# EAGLE design 555-Sawtooth-VCO (EAGLE 7.2.0)
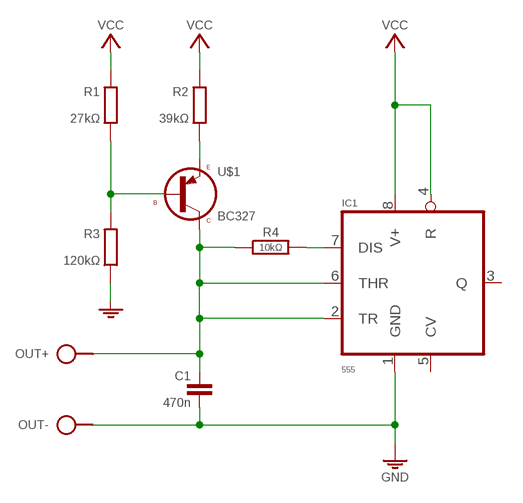
[diagram p0: schematic, sheet 1]

## Parts
C1  470n  C075-020X044/V  [C075-020X044/V]
IC1  555  555_ALT  [DIL08]
OUT  SPAD+--+  [SPAD-+]
R1  27kΩ  R0207/10  [0207/10]
R2  39kΩ  R0207/10  [0207/10]
R3  120kΩ  R0207/10  [0207/10]
R4  10kΩ  R-H0204/10  [0204/10]
S1  VCC_GNDPWR-R  [PWR-R]
U$1  BC327  [TO92]

## Nets
GND: C1.2 IC1.1(GND) OUT.1 R3.2 S1.1
N$2: IC1.7(DIS) R4.2
N$3: R2.2 U$1.3(E)
N$4: R1.2 R3.1 U$1.2(B)
TR: C1.1 IC1.2(TR) IC1.6(THR) OUT.2 R4.1 U$1.1(C)
VCC: IC1.4(R) IC1.8(V+) R1.1 R2.1 S1.2
Unconnected: IC1.3(Q) IC1.5(CV)

## Library data of the parts
C1 = c:C: CAPACITOR, European symbol
IC1 = ic:*555_ALT
OUT = pad:SPAD+-
R1-R3 = r:R: RESISTOR, European symbol
R4 = r:R-H
S1 = pad:VCC_GND
U$1 = t:BC327

## Board
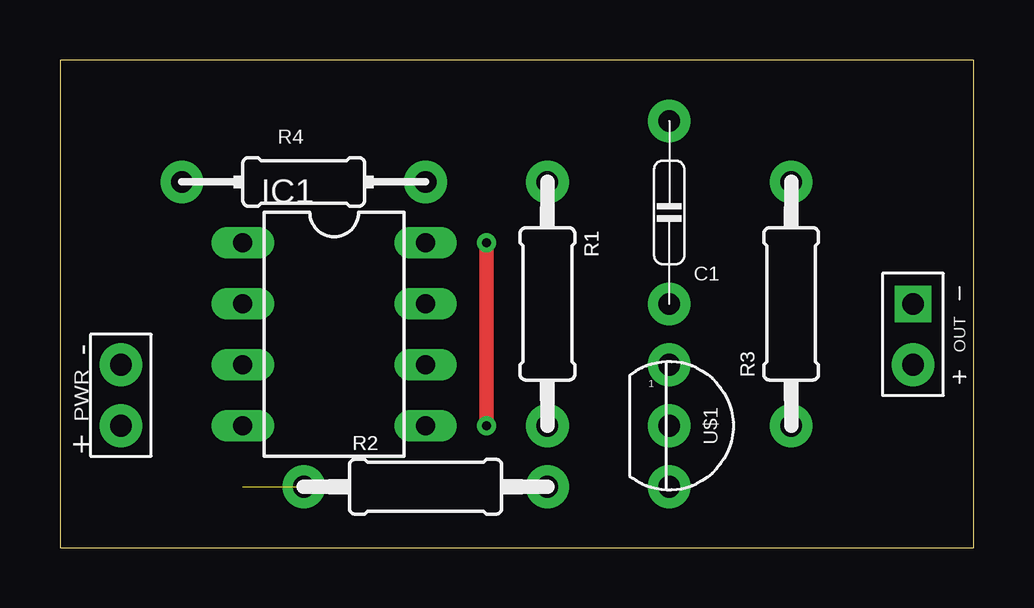
[diagram p1: board, top side]
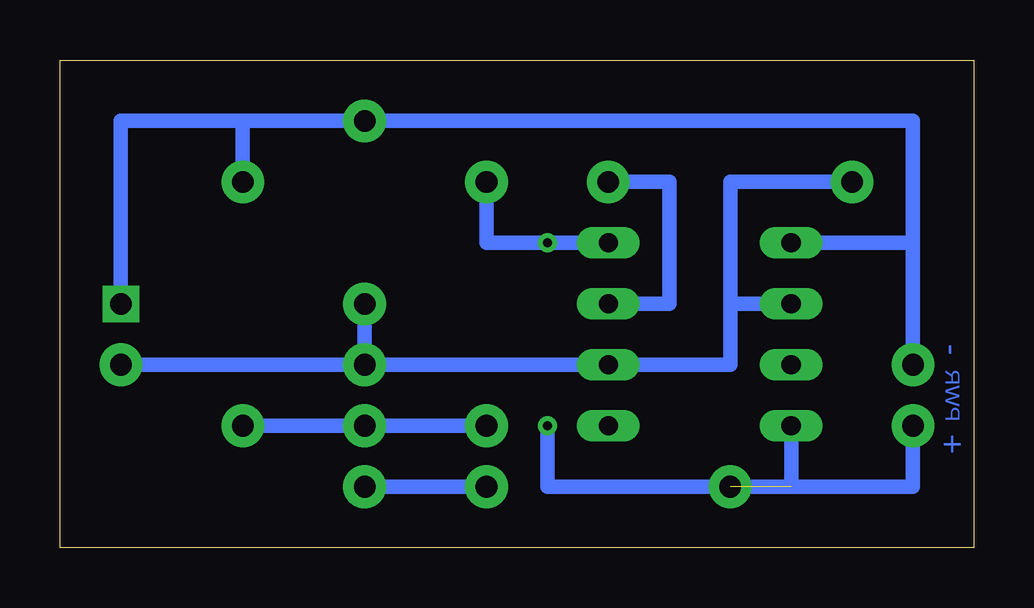
[diagram p2: board, bottom side, seen from below]

Size 38.1 x 20.32 mm. Coordinates in mm from the lower left corner, seen from the top.
Outline: 0,0 38.1,0 38.1,20.32 0,20.32 0,0
Copper layers (1*16): Top 0.035mm / dielectric 1.5mm / Bottom 0.035mm
Design rules "default": minimum track width 10mil, minimum drill 24mil, track to track 8mil, track to pad 8mil, pad to pad 8mil, via to via 8mil, smd to smd 8mil, copper to edge 40mil, drill to drill 8mil, minimum pad ring 10mil, minimum via ring 8mil, stop-mask expansion 4mil, vias tented up to drill 0mil, thermal gap 10mil

### Footprints (pad centres in the part's own frame; a part is rotated, then mirrored left to right if it is on the bottom)
C075-020X044/V = drill 0.9 pad 1.778: 1 0,3.81; 2 0,-3.81
DIL08 = drill 0.8 pad 1.27 long: 1 -3.81,3.81; 2 -3.81,1.27; 3 -3.81,-1.27; 4 -3.81,-3.81; 5 3.81,-3.81; 6 3.81,-1.27; 7 3.81,1.27; 8 3.81,3.81
SPAD-+ = drill 0.9 pad 1.524 square: 1 0,-1.27 | drill 0.9 pad 1.778: 2 0,1.27
0207/10 = drill 0.9 pad 1.778: 1 -5.08,0; 2 5.08,0
0204/10 = drill 0.9 pad 1.778: 1 -5.08,0; 2 5.08,0
PWR-R = drill 0.9 pad 1.778: 1 0,-1.27; 2 0,1.27
TO92 = drill 0.9 pad 1.778: 1 0,2.54; 2 0,0; 3 0,-2.54

### Placement (x,y rotation side)
C1  25.4,13.97 180 top
IC1  11.43,8.89 0 top
OUT  35.56,8.89 180 top
R1  20.32,10.16 270 top
R2  15.24,2.54 0 top
R3  30.48,10.16 90 top
R4  10.16,15.24 0 top
S1  2.54,6.35 180 top
U$1  25.4,5.08 0 top

### Tracks (layer width: path | path; a pad name or v marks a point on that pad's centre or on a via)
GND
  Bottom 0.61: 2.54,12.7 S1.1 | IC1.1 2.54,12.7 | 2.54,12.7 2.54,17.78 C1.2 30.48,17.78 | R3.2 30.48,17.78 | 30.48,17.78 35.56,17.78 OUT.1
N$2
  Bottom 0.61: R4.2 12.7,15.24 12.7,10.16 IC1.7
N$3
  Bottom 0.61: U$1.3 R2.2
N$4
  Bottom 0.61: R3.1 R1.2 U$1.2
TR
  Bottom 0.61: 10.16,10.16 10.16,7.62 IC1.6 U$1.1 | 10.16,10.16 IC1.2 | R4.1 10.16,15.24 10.16,10.16 | OUT.2 U$1.1 | U$1.1 C1.1
VCC  (via drill 0.38)  (1 unrouted)
  Top 0.61: v17.78,12.7 v17.78,5.08
  Bottom 0.61: R1.1 20.32,12.7 v17.78,12.7 IC1.8 | 7.62,2.54 17.78,2.54 v17.78,5.08 | S1.2 2.54,2.54 7.62,2.54 | 7.62,2.54 IC1.4